# EAGLE design radio (EAGLE 9.6.1)
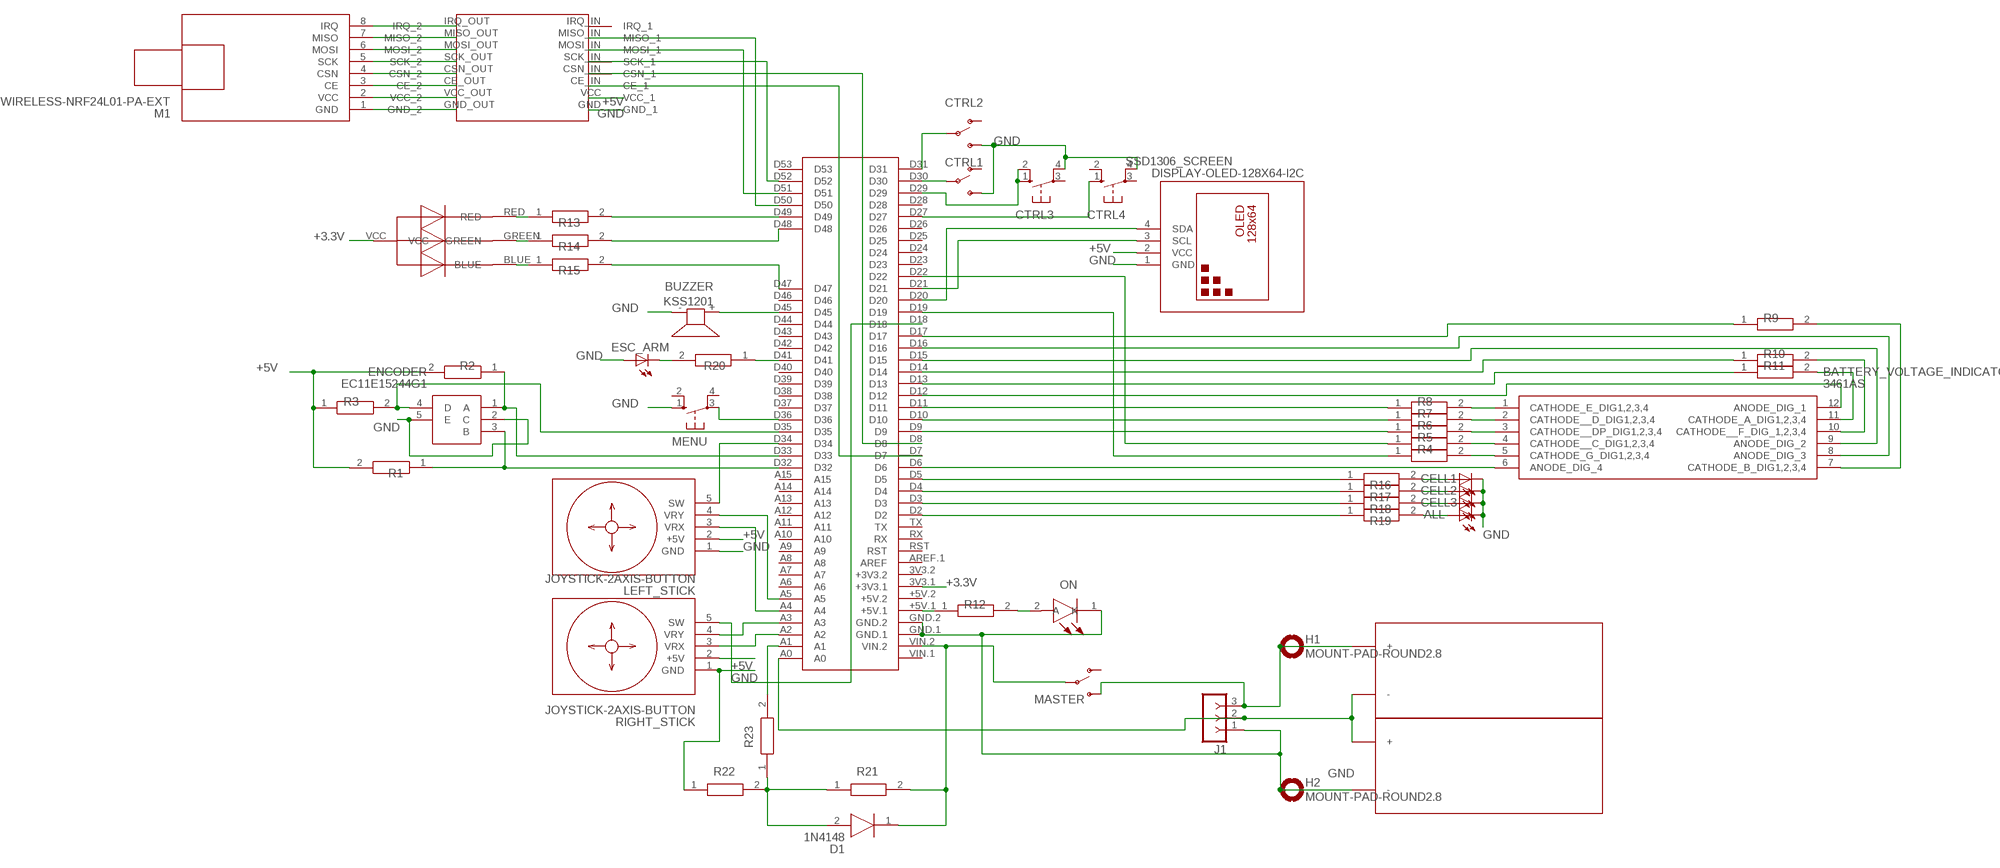
[diagram p0: schematic, sheet 1]

## Parts
ALL  LED3MM  [LED3MM]
BATTERY_VOLTAGE_INDICATOR  3461AS  [DIPS1016W45P254L3000H740Q12N]
BUZZER  KSS1201  [KSS1201]
CELL1  LED3MM  [LED3MM]
CELL2  LED3MM  [LED3MM]
CELL3  LED3MM  [LED3MM]
CTRL1  SWITCH-SPDT-PTH-8.6X4.3MM  [SWITCH_SPDT_8.6X4.3MM]
CTRL2  SWITCH-SPDT-PTH-8.6X4.3MM  [SWITCH_SPDT_8.6X4.3MM]
CTRL3  10-XX  [B3F-10XX]
CTRL4  10-XX  [B3F-10XX]
D1  1N4148  [DIOAD1165W56L425D185]
ENCODER  EC11E15244G1  [EC11E1544505]
ESC_ARM  LED3MM  [LED3MM]
GEAR  5MMRGBLED  [LED5MMRGB]
H1  MOUNT-PAD-ROUND2.8  [2,8-PAD]
H2  MOUNT-PAD-ROUND2.8  [2,8-PAD]
J1  F-1X03-SIP-100-32  [SIP-100-03-32]
LEFT_STICK  JOYSTICK-2AXIS-BUTTON  [JOYSTICK-2AXIS-BUTTON]
M1  WIRELESS-NRF24L01-PA-EXT  [WIRELESS-NRF24L01-PA-EXT]
MASTER  SWITCH-SPDT-PTH-8.6X4.3MM  [SWITCH_SPDT_8.6X4.3MM]
MENU  10-XX  [B3F-10XX]
ON  SSL-LX5093UWC_G  [SSL-LX5093SGC/B]
R1  CRCW120610K0FKEAHP  [RESC3116X65N]
R2  CRCW120610K0FKEAHP  [RESC3116X65N]
R3  CRCW120610K0FKEAHP  [RESC3116X65N]
R4  CR1206-FX-3300ELF  [RESC3216X75N]
R5  CR1206-FX-3300ELF  [RESC3216X75N]
R6  CR1206-FX-3300ELF  [RESC3216X75N]
R7  CR1206-FX-3300ELF  [RESC3216X75N]
R8  CR1206-FX-3300ELF  [RESC3216X75N]
R9  CR1206-FX-3300ELF  [RESC3216X75N]
R10  CR1206-FX-3300ELF  [RESC3216X75N]
R11  CR1206-FX-3300ELF  [RESC3216X75N]
R12  CRCW1206470RFKEA  [RESC3216X60N]
R13  CR1206-FX-3300ELF  [RESC3216X75N]
R14  CR1206-FX-3300ELF  [RESC3216X75N]
R15  CR1206-FX-3300ELF  [RESC3216X75N]
R16  CRG1206F150R  [RESC3116X65N]
R17  CRG1206F150R  [RESC3116X65N]
R18  CRG1206F150R  [RESC3116X65N]
R19  CRG1206F150R  [RESC3116X65N]
R20  CRG1206F150R  [RESC3116X65N]
R21  CRS1206-FX-1001ELF  [RESC3116X65N]
R22  CRS1206-FX-1001ELF  [RESC3116X65N]
R23  CRS1206-FX-1001ELF  [RESC3116X65N]
RIGHT_STICK  JOYSTICK-2AXIS-BUTTON  [JOYSTICK-2AXIS-BUTTON]
SSD1306_SCREEN  DISPLAY-OLED-128X64-I2C  [DISPLAY-OLED-128X64-I2C]
U$1  LIPO-CELL  (no package)
U$2  LIPO-CELL  (no package)
U$3  YL-105-ADAPTER-NRF24L01  [YL-105]
U$8  MEGA2560_MIKRO  [MEGA2560_MIKRO]

## Nets
+3.3V [test]: GEAR.VCC U$8.3V3.1(+3V3.1)
+5V [master]: LEFT_STICK.2(+5V) R1.2 R2.2 R3.1 RIGHT_STICK.2(+5V) SSD1306_SCREEN.2(VCC) U$3.VCC(VCC_1)
GND [master]: ALL.K(C) BUZZER.- CELL1.K(C) CELL2.K(C) CELL3.K(C) CTRL1.3(S) CTRL2.3(S) CTRL3.4(P1) CTRL4.4(P1) ENCODER.2(C) ENCODER.5(E) ESC_ARM.A H2.B2,8(MOUNT) J1.1 LEFT_STICK.1(GND) MENU.1(S) ON.1(K) R22.1 RIGHT_STICK.1(GND) SSD1306_SCREEN.1(GND) U$2.- U$3.GND(GND_1) U$8.GND.1 U$8.GND.2
N$1 [test]: M1.1(GND) U$3.GND_OUT(GND_2)
N$2 [test]: M1.2(VCC) U$3.VCC_OUT(VCC_2)
N$3 [test]: M1.3(CE) U$3.CE_OUT(CE_2)
N$4 [test]: M1.4(CSN) U$3.CSN_OUT(CSN_2)
N$5 [test]: M1.5(SCK) U$3.SCK_OUT(SCK_2)
N$6 [test]: M1.6(MOSI) U$3.MOSI_OUT(MOSI_2)
N$7 [test]: M1.7(MISO) U$3.MISO_OUT(MISO_2)
N$8 [test]: M1.8(IRQ) U$3.IRQ_OUT(IRQ_2)
N$9 [test]: J1.2 U$1.- U$2.+ U$8.A0
N$10 [test]: R23.2 U$8.A1
N$11 [test]: BATTERY_VOLTAGE_INDICATOR.6(ANODE_DIG_4) U$8.D6
N$12 [test]: BATTERY_VOLTAGE_INDICATOR.5(CATHODE_G_DIG1,2,3,4) R6.2
N$13 [test]: R6.1 U$8.D19
N$14 [test]: BATTERY_VOLTAGE_INDICATOR.4(CATHODE__C_DIG1,2,3,4) R5.2
N$15 [test]: R5.1 U$8.D22
N$16 [test]: R4.1 U$8.D9
N$17 [test]: R7.1 U$8.D10
N$18 [test]: R8.1 U$8.D11
N$19 [test]: BATTERY_VOLTAGE_INDICATOR.1(CATHODE_E_DIG1,2,3,4) R8.2
N$20 [test]: BATTERY_VOLTAGE_INDICATOR.2(CATHODE__D_DIG1,2,3,4) R7.2
N$21 [test]: BATTERY_VOLTAGE_INDICATOR.3(CATHODE__DP_DIG1,2,3,4) R4.2
N$22 [test]: BATTERY_VOLTAGE_INDICATOR.12(ANODE_DIG_1) U$8.D12
N$23 [test]: R11.1 U$8.D13
N$24 [test]: R10.1 U$8.D14
N$25 [test]: BATTERY_VOLTAGE_INDICATOR.9(ANODE_DIG_2) U$8.D15
N$26 [test]: BATTERY_VOLTAGE_INDICATOR.8(ANODE_DIG_3) U$8.D16
N$27 [test]: R9.1 U$8.D17
N$28 [test]: RIGHT_STICK.4(VRY) U$8.A3
N$29 [test]: RIGHT_STICK.3(VRX) U$8.A2
N$30 [test]: LEFT_STICK.3(VRX) U$8.A4
N$31 [test]: LEFT_STICK.4(VRY) U$8.A5
N$32 [test]: BATTERY_VOLTAGE_INDICATOR.7(CATHODE_B_DIG1,2,3,4) R9.2
N$33 [test]: BATTERY_VOLTAGE_INDICATOR.10(CATHODE__F_DIG_1,2,3,4) R10.2
N$34 [test]: BATTERY_VOLTAGE_INDICATOR.11(CATHODE_A_DIG1,2,3,4) R11.2
N$35 [test]: SSD1306_SCREEN.4(SDA) U$8.D20
N$36 [test]: SSD1306_SCREEN.3(SCL) U$8.D21
N$37 [test]: ENCODER.1(A) R2.1 U$8.D33
N$38 [test]: ENCODER.3(B) R1.1 U$8.D32
N$39 [test]: ENCODER.4(D) R3.2 U$8.D35
N$40 [test]: D1.2(A) R21.1 R22.2 R23.1
N$41 [test]: LEFT_STICK.5(SW) U$8.D34
N$42 [test]: CELL1.A R16.2
N$43 [test]: BUZZER.+ U$8.D45
N$44 [test]: RIGHT_STICK.5(SW) U$8.D18
N$45 [test]: CELL2.A R17.2
N$46 [test]: CELL3.A R18.2
N$47 [test]: ALL.A R19.2
N$48 [test]: MENU.3(P) U$8.D36
N$49 [test]: ON.2(A) R12.2
N$50 [test]: CTRL1.2(P) U$8.D30
N$51 [test]: CTRL2.2(P) U$8.D31
N$52 [test]: CTRL3.1(S) CTRL3.2(S1) U$8.D29
N$53 [test]: CTRL4.1(S) U$8.D27
N$55 [test]: R12.1 U$8.+5V.1
N$56 [test]: GEAR.RED R13.1
N$57 [test]: GEAR.GREEN R14.1
N$58 [test]: GEAR.BLUE R15.1
N$59 [test]: R13.2 U$8.D49
N$60 [test]: R14.2 U$8.D48
N$61 [test]: R15.2 U$8.D47
N$62 [test]: R16.1 U$8.D5
N$63 [test]: R17.1 U$8.D4
N$64 [test]: R18.1 U$8.D3
N$65 [test]: R19.1 U$8.D2
N$66 [test]: U$3.MISO_IN(MISO_1) U$8.D50
N$67 [test]: U$3.MOSI_IN(MOSI_1) U$8.D51
N$68 [test]: U$3.SCK_IN(SCK_1) U$8.D52
N$69 [test]: U$3.CSN_IN(CSN_1) U$8.D8
N$70 [test]: U$3.CE_IN(CE_1) U$8.D7
N$71 [test]: R20.1 U$8.D41
N$72 [test]: ESC_ARM.K(C) R20.2
VIN [master]: H1.B2,8(MOUNT) J1.3 MASTER.3(S) U$1.+
VIN_SW [master]: D1.1(K) MASTER.2(P) R21.2 U$8.VIN.2
Unconnected: CTRL1.1(O) CTRL2.1(O) CTRL3.3(P) CTRL4.2(S1) CTRL4.3(P) MASTER.1(O) MENU.2(S1) MENU.4(P1) U$3.IRQ_IN(IRQ_1) U$8.3V3.2(+3V3.2) U$8.+5V.2 U$8.A6 U$8.A7 U$8.A8 U$8.A9 U$8.A10 U$8.A11 U$8.A12 U$8.A13 U$8.A14 U$8.A15 U$8.AREF.1(AREF) U$8.D23 U$8.D24 U$8.D25 U$8.D26 U$8.D28 U$8.D37 U$8.D38 U$8.D39 U$8.D40 U$8.D42 U$8.D43 U$8.D44 U$8.D46 U$8.D53 U$8.RST U$8.RX U$8.TX U$8.VIN.1

## Library data of the parts
ALL CELL1-CELL3 ESC_ARM = adafruit:LED: LED OSRAM: - CHIPLED LG R971, LG N971, LY N971, LG Q971, LY Q971, LO R971, LY R971 LH N974, LH R974 LS Q976, LO Q976, LY Q976 LO Q996 - Hyper CHIPLED LW Q18S LB Q993, LB Q99A, LB R99A - SideLED LS A670, LO A670, LY A670, LG A670, LP A670 LB A673, LV A673, LT A673, LW A673 LH A674 LY A675 LS A676, LA A676, LO A676, LY A676, LW A676 LS A679, LY A679, LG A679 - Hyper Micro SIDELED® LS Y876, LA Y876, LO Y876, LY Y876 LT Y87S - SmartLED LW L88C, LW L88S LB L89C, LB L89S, LG L890 LS L89K, LO L89K, LY L89K LS L896, LA L896, LO L896, LY L896 - TOPLED LS T670, LO T670, LY T670, LG T670, LP T670 LSG T670, LSP T670, LSY T670, LOP T670, LYG T670 LG T671, LOG T671, LSG T671 LB T673, LV T673, LT T673, LW T673 LH T674 LS T676, LA T676, LO T676, LY T676, LB T676, LH T676, LSB T676, LW T676 LB T67C, LV T67C, LT T67C, LS T67K, LO T67K, LY T67K, LW E67C LS E67B, LA E67B, LO E67B, LY E67B, LB E67C, LV E67C, LT E67C LW T67C LS T679, LY T679, LG T679 LS T770, LO T770, LY T770, LG T770, LP T770 LB T773, LV T773, LT T773, LW T773 LH T774 LS E675, LA E675, LY E675, LS T675 LS T776, LA T776, LO T776, LY T776, LB T776 LHGB T686 LT T68C, LB T68C - Hyper Mini TOPLED® LB M676 - Mini TOPLED Santana® LG M470 LS M47K, LO M47K, LY M47K Source: http://www.osram.convergy.de/
BATTERY_VOLTAGE_INDICATOR = 3461AS:3461AS: Four digit Led Digit Display Source: Datasheet; ARROW_PART_NUMBER: 3461AS; DESCRIPTION: Four digit Led Digit Display; HEIGHT: 7.4mm; MANUFACTURER_NAME: ZHONGSHAN SILSMART OPTOELECTRONICS; MANUFACTURER_PART_NUMBER: 3461AS
BUZZER = buzzer:KSS1201: SPEAKER Source: Schukat; OC_FARNELL: unknown; OC_NEWARK: unknown
CTRL1 CTRL2 MASTER = SparkFun-Switches:SWITCH-SPDT: Single Pole, Double Throw (SPDT) Switch Single-pole, double-throw (SPDT) switch. Variant Overview SMD-AYZ0202 Surface Mount DPDT Switch (COM-00597) Used on e.g. LilyPad Arduino USB - ATmega32U4 Board PTH-11.6X4.0MM SPDT Mini Power Switch (COM-00102) Used on e.g. SparkFun Simon Says - Through-Hole Soldering Kit (KIT-10547) PTH-11.6X4.0MM-KIT KIT version of SPDT Mini Power Switch - Simplifies soldering by removing tStop of switch pins - only one side can be soldered. PTH-11.6X4.0MM-LOCK LOCK version of SPDT Mini Power Switch - Offset pins hold switch in place for easier soldering. SMD-RIGHT-ANGLE Surface Mount Right Angle Switch (COM-10860) Used on e.g. SparkFun ESP8266 Thing; PROD_ID: SWCH-14746
CTRL3 CTRL4 MENU = switch-omron:10-XX: OMRON SWITCH; MPN: B3F-1000; OC_FARNELL: 176432; OC_NEWARK: 36M3542
D1 = 1N4148:1N4148: 1N4148 Switching Diode, 300mA 100V, 2-Pin DO-35 Source: Datasheet; ARROW_PART_NUMBER: 1N4148; DESCRIPTION: 1N4148 Switching Diode, 300mA 100V, 2-Pin DO-35; HEIGHT: mm; MANUFACTURER_NAME: Nexperia; MANUFACTURER_PART_NUMBER: 1N4148
ENCODER = EC11E15244G1:EC11E15244G1: Alps 15 Pulse Incremental Mechanical Rotary Encoder with a 6 mm Flat Shaft (Not Indexed), Through Hole Source: Datasheet; ARROW_PART_NUMBER: EC11E15244G1; DESCRIPTION: Alps 15 Pulse Incremental Mechanical Rotary Encoder with a 6 mm Flat Shaft (Not Indexed), Through Hole; HEIGHT: mm; MANUFACTURER_NAME: ALPS; MANUFACTURER_PART_NUMBER: EC11E15244G1; MOUSER_PART_NUMBER: 688-EC11E15244G1; MOUSER_PRICE-STOCK: https://www.mouser.com/Search/Refine.aspx?Keyword=688-EC11E15244G1
GEAR = led_rgb:5MMRGBLED
H1 H2 = holes:MOUNT-PAD-ROUND: MOUNTING PAD, round
J1 = con-headers-jp:F-1X03-: FEMALE HEADER
LEFT_STICK RIGHT_STICK = diy-modules:JOYSTICK-2AXIS-BUTTON: 2-Axis Analog Joystick with Push Button Tutorial is available here: http://henrysbench.capnfatz.com/henrys-bench/arduino-sensors-and-input/arduino-ps2-joystick-tutorial-keyes-ky-023-deek-robot/ Click here to find device on ebay.com
M1 = diy-modules:WIRELESS-NRF24L01-PA-EXT: 2.4 GHz Wireless Module based on NRF24L01 chip with preamplifier and external antenna Click here to find device on ebay.com
ON = SamacSys_Parts:SSL-LX5093UWC_G: Lumex SSL-LX5093UWC/G White LED, 5mm (T-1 3/4) Clear, Dome Lens Through Hole Package Source: Datasheet; DESCRIPTION: Lumex SSL-LX5093UWC/G White LED, 5mm (T-1 3/4) Clear, Dome Lens Through Hole Package; HEIGHT: mm; MANUFACTURER_NAME: Lumex; MANUFACTURER_PART_NUMBER: SSL-LX5093UWC/G; MOUSER_PART_NUMBER: 696-SSL-LX5093UWC/G; MOUSER_PRICE-STOCK: https://www.mouser.com/Search/Refine.aspx?Keyword=696-SSL-LX5093UWC%2FG; RS_PART_NUMBER: 8887206; RS_PRICE-STOCK: http://uk.rs-online.com/web/p/products/8887206
R1-R3 = CRCW120610K0FKEAHP:CRCW120610K0FKEAHP: Thick Film Resistors - SMD 1/2watt 10Kohms 1% 100ppm High Power Source: Datasheet; ARROW_PART_NUMBER: CRCW120610K0FKEAHP; ARROW_PRICE-STOCK: https://www.arrow.com/en/products/crcw120610k0fkeahp/vishay; DESCRIPTION: Thick Film Resistors - SMD 1/2watt 10Kohms 1% 100ppm High Power; HEIGHT: 0.65mm; MANUFACTURER_NAME: Vishay; MANUFACTURER_PART_NUMBER: CRCW120610K0FKEAHP; MOUSER_PART_NUMBER: 71-CRCW120610K0FKEAH; MOUSER_PRICE-STOCK: https://www.mouser.co.uk/ProductDetail/Vishay-Dale/CRCW120610K0FKEAHP?qs=sV%252BHhSlSMtlZIIGeH8S5qg%3D%3D
R4-R11 R13-R15 = CR1206-FX-3300ELF:CR1206-FX-3300ELF: SMD 1206 thick film resistor 330R 1% Bourns CR1206-FX Series Surface Mount Fixed Resistor 1206 Case 330 +/-1% 0.25W +/-100ppm/C Source: Datasheet; ARROW_PART_NUMBER: CR1206-FX-3300ELF; ARROW_PRICE-STOCK: https://www.arrow.com/en/products/cr1206-fx-3300elf/bourns; DESCRIPTION: SMD 1206 thick film resistor 330R 1% Bourns CR1206-FX Series Surface Mount Fixed Resistor 1206 Case 330 +/-1% 0.25W +/-100ppm/C; HEIGHT: 0.75mm; MANUFACTURER_NAME: Bourns; MANUFACTURER_PART_NUMBER: CR1206-FX-3300ELF; MOUSER_PART_NUMBER: 652-CR1206FX-3300ELF; MOUSER_PRICE-STOCK: https://www.mouser.co.uk/ProductDetail/Bourns/CR1206-FX-3300ELF?qs=raSpJxvwqHEmBNP%252BYszUFw%3D%3D
R12 = CRCW1206470RFKEA:CRCW1206470RFKEA: VISHAY DRALORIC - CRCW1206470RFKEA - RES, THICK FILM, 470R, 1%, 0.25W, 1206 Source: Datasheet; ARROW_PART_NUMBER: CRCW1206470RFKEA; ARROW_PRICE-STOCK: https://www.arrow.com/en/products/crcw1206470rfkea/vishay; DESCRIPTION: VISHAY DRALORIC - CRCW1206470RFKEA - RES, THICK FILM, 470R, 1%, 0.25W, 1206; HEIGHT: 0.6mm; MANUFACTURER_NAME: Vishay; MANUFACTURER_PART_NUMBER: CRCW1206470RFKEA; MOUSER_PART_NUMBER: 71-CRCW1206-470-E3; MOUSER_PRICE-STOCK: https://www.mouser.co.uk/ProductDetail/Vishay-Dale/CRCW1206470RFKEA?qs=9sFvXT%252Bien0hfb5%2FAQcBUQ%3D%3D
R16-R20 = CRG1206F150R:CRG1206F150R: CRG1206 SMT chip resistor,150R 0.25W TE Connectivity CRG1206 Series Thick Film Surface Mount Resistor 1206 Case 150 +/-1% 0.25W +/-100ppm/C Source: Datasheet; ARROW_PART_NUMBER: CRG1206F150R; ARROW_PRICE-STOCK: https://www.arrow.com/en/products/crg1206f150r/te-connectivity; DESCRIPTION: CRG1206 SMT chip resistor,150R 0.25W TE Connectivity CRG1206 Series Thick Film Surface Mount Resistor 1206 Case 150 +/-1% 0.25W +/-100ppm/C; HEIGHT: 0.65mm; MANUFACTURER_NAME: TE Connectivity; MANUFACTURER_PART_NUMBER: CRG1206F150R; MOUSER_PART_NUMBER: 279-CRG1206F150R; MOUSER_PRICE-STOCK: https://www.mouser.com/Search/Refine.aspx?Keyword=279-CRG1206F150R
R21-R23 = CRS1206-FX-1001ELF:CRS1206-FX-1001ELF: 1k 1206 Thick Film Anti Surge Fixed Resistor +/-1% 0.5W CRS1206-FX-1001ELF Source: Datasheet; ARROW_PART_NUMBER: CRS1206-FX-1001ELF; ARROW_PRICE-STOCK: https://www.arrow.com/en/products/crs1206-fx-1001elf/bourns; DESCRIPTION: 1k 1206 Thick Film Anti Surge Fixed Resistor +/-1% 0.5W CRS1206-FX-1001ELF; HEIGHT: 0.65mm; MANUFACTURER_NAME: Bourns; MANUFACTURER_PART_NUMBER: CRS1206-FX-1001ELF; MOUSER_PART_NUMBER: 652-CRS1206FX1001ELF; MOUSER_PRICE-STOCK: https://www.mouser.com/Search/Refine.aspx?Keyword=652-CRS1206FX1001ELF
SSD1306_SCREEN = diy-modules:DISPLAY-OLED-128X64-I2C: 128x64 Dot Matrix OLED Module based on SSD1306 chip Variant with I2C interface More details available here: http://www.instructables.com/id/Monochrome-096-i2c-OLED-display-with-arduino-SSD13/ SSD1306 datasheet: https://cdn-shop.adafruit.com/datasheets/SSD1306.pdf Click here to find device on ebay.com Note: There are two variants: I2C and SPI. Search for the proper version.
U$1 U$2 = SamacSys_Parts:LIPO-CELL
U$3 = diy-modules:YL-105-ADAPTER-NRF24L01
U$8 = MIKRO_MEGA2560:MEGA2560_MIKRO: Arduino Mega2560 pro robotDyn, create by mikroavr.com

## Module KY-040
Ports: 

### Library data of the parts

## Net classes
0 default: width 0.61 mm
1 test: width 0.61 mm, clearance 0.051 mm
2 master: width 0.762 mm, clearance 0.254 mm

## Board
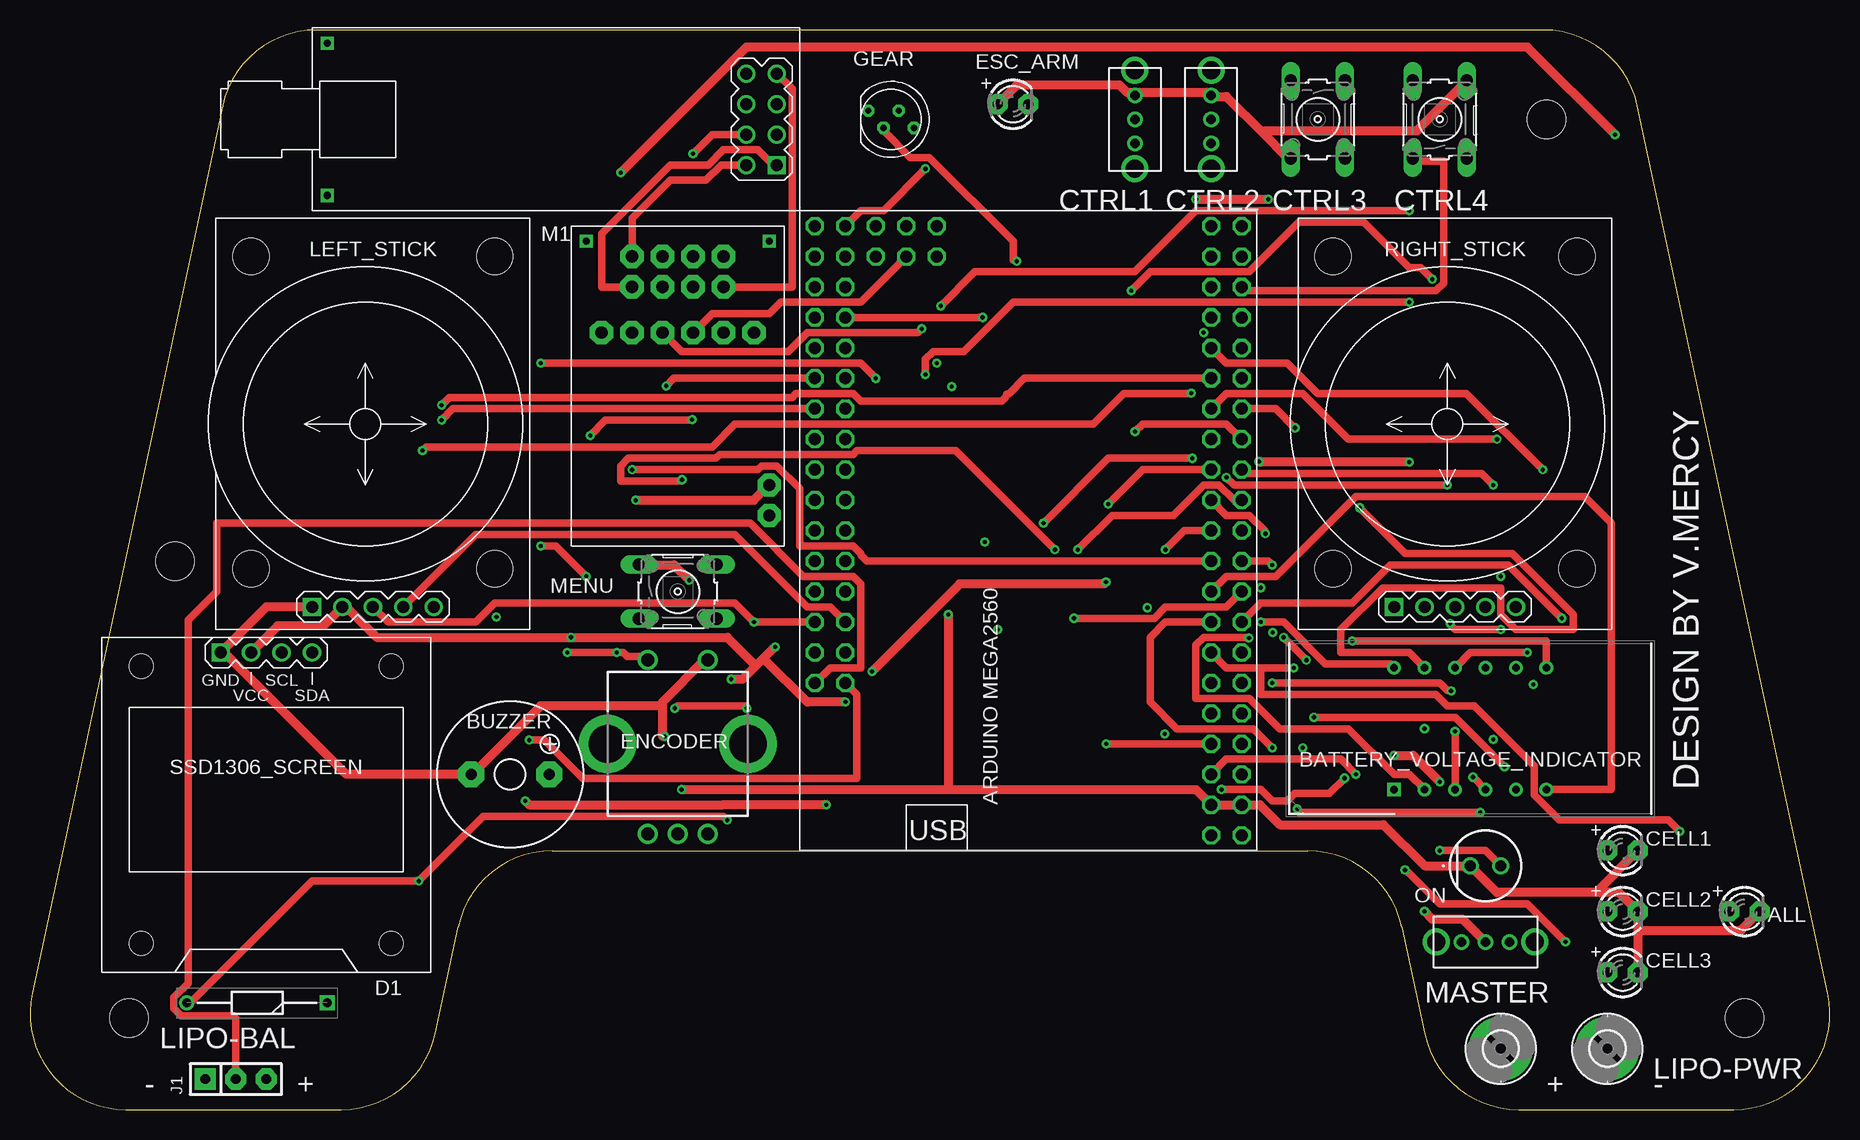
[diagram p1: board, top side]
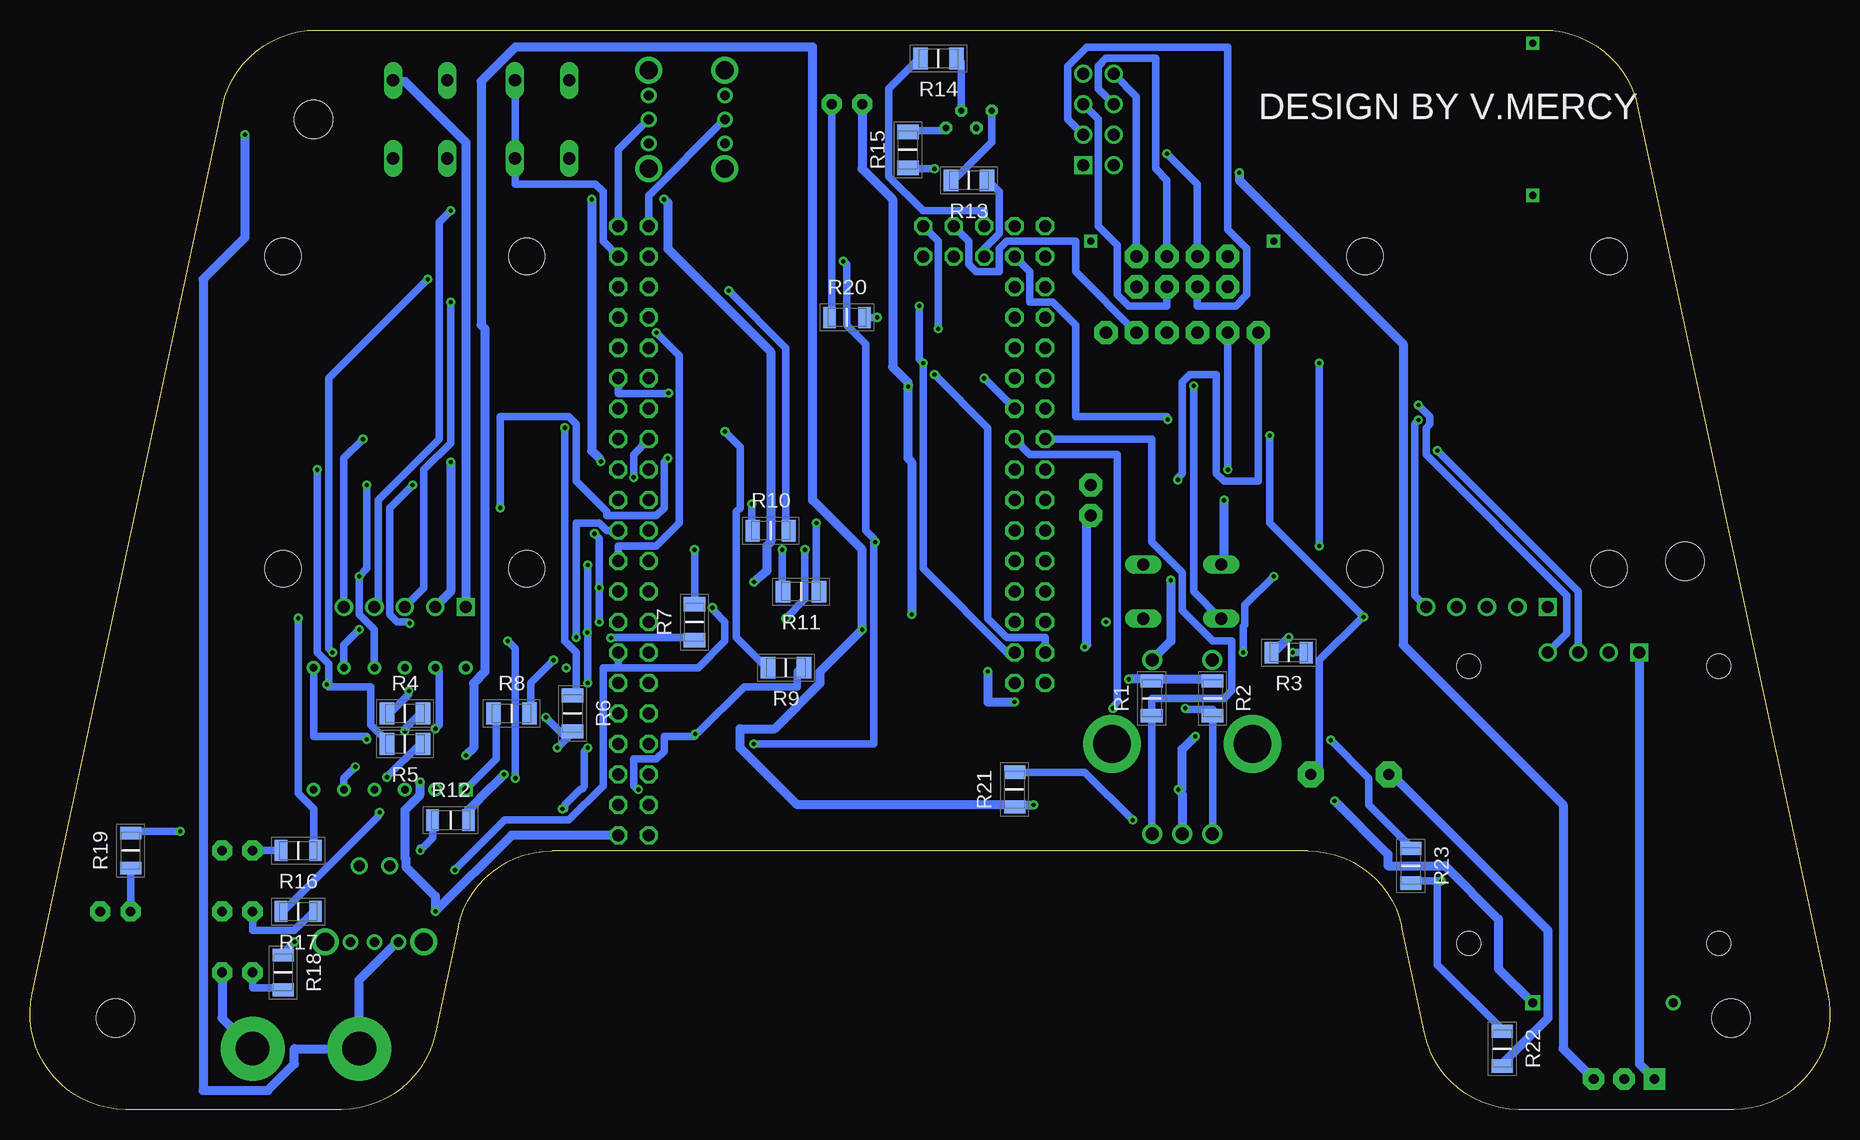
[diagram p2: board, bottom side, seen from below]

Size 150 x 90 mm. Coordinates in mm from the lower left corner, seen from the top.
Outline: 23.87,90 arc78 16.04,83.68 0.18,9.68 arc102 8,0 25.95,0 arc78 33.77,6.32 35.68,15.24 arc-78 43.5,21.56 106.49,21.56 arc-78 114.32,15.24 116.23,6.32 arc78 124.05,0 142,0 arc102 149.82,9.68 133.95,83.68 arc78 126.13,90 23.87,90
Copper layers (1*16): Top 0.035mm / dielectric 1.5mm / Bottom 0.035mm
Design rules "default": minimum track width 6mil, minimum drill 0.35mm, track to track 6mil, track to pad 6mil, pad to pad 6mil, via to via 6mil, smd to smd 6mil, copper to edge 40mil, drill to drill 6mil, minimum pad ring 10mil, minimum via ring 8mil, stop-mask expansion 4mil, vias tented up to drill 0mil, thermal gap 10mil
Holes 3.2 mm at 8.26,7.62 12.07,45.72 126.37,82.55 142.88,7.62

### Footprints (pad centres in the part's own frame; a part is rotated, then mirrored left to right if it is on the bottom)
LED3MM = drill 0.813 pad 1.676 octagon: A -1.27,0; K 1.27,0
DIPS1016W45P254L3000H740Q12N = drill 0.65 pad 1.05 square: 1 0,0 | drill 0.65 pad 1.05: 2 0,-2.54; 3 0,-5.08; 4 0,-7.62; 5 0,-10.16; 6 0,-12.7; 7 10.16,-12.7; 8 10.16,-10.16; 9 10.16,-7.62; 10 10.16,-5.08; 11 10.16,-2.54; 12 10.16,0
KSS1201 = drill 0.914 pad 2.159 octagon: + 3.251,0; - -3.251,0
SWITCH_SPDT_8.6X4.3MM = drill 0.8: 1 -2,0; 2 0,0; 3 2,0 | drill 1.5: 4 -4.1,0; 5 4.1,0
B3F-10XX = drill 1.016 long: 1 -3.251,2.261; 2 3.251,2.261; 3 -3.251,-2.261; 4 3.251,-2.261
DIOAD1165W56L425D185 = drill 0.75 pad 1.15 square: 1 0,0 | drill 0.75 pad 1.15: 2 11.7,0
EC11E1544505 = drill 1.1 pad 1.65: 1 -2.5,-7.5; 2 0,-7.5; 3 2.5,-7.5; 4 -2.5,7; 5 2.5,7 | drill 3.14 pad 4.8: 6 -5.85,0; 7 5.85,0
LED5MMRGB = drill 0.508 pad 0.813 octagon: BLUE 1.905,-0.714; GREEN 0.635,0.714; RED -1.905,0.714; VCC -0.635,-0.714
2,8-PAD = drill 2.8 pad 5.334: B2,8 0,0
SIP-100-03-32 = drill 0.813 pad 1.778 square: 1 -2.54,0 | drill 0.813 pad 1.778 octagon: 2 0,0; 3 2.54,0
JOYSTICK-2AXIS-BUTTON = drill 1 square: 1 -15.24,5.08 | drill 1: 2 -15.24,2.54; 3 -15.24,0; 4 -15.24,-2.54; 5 -15.24,-5.08 | hole 3: -12.065,10.16; -12.065,-10.16; 13.97,-10.16; 13.97,10.16
WIRELESS-NRF24L01-PA-EXT = drill 1 square: 1 -18.415,3.81 | drill 1: 2 -15.875,3.81; 3 -18.415,1.27; 4 -15.875,1.27; 5 -18.415,-1.27; 6 -15.875,-1.27; 7 -18.415,-3.81; 8 -15.875,-3.81 | drill 0.6 square: P$1 19.05,6.35; P$2 19.05,-6.35
SSL-LX5093SGC/B = drill 0.91 pad 1.4: 1 1.27,0; 2 -1.27,0
RESC3116X65N = smd 1.1 x 1.8: 1 -1.45,0; 2 1.45,0
RESC3216X75N = smd 1.2 x 1.8: 1 -1.5,0; 2 1.5,0
RESC3216X60N = smd 1.05 x 1.8: 1 -1.5,0; 2 1.5,0
RESC3116X65N' = smd 1.05 x 1.75: 1 -1.45,0; 2 1.45,0
RESC3116X65N'' = smd 1.1 x 1.75: 1 -1.45,0; 2 1.45,0
DISPLAY-OLED-128X64-I2C = drill 1 square: 1 -3.81,12.7 | drill 1: 2 -1.27,12.7; 3 1.27,12.7; 4 3.81,12.7 | hole 2: -10.414,11.557; 10.414,11.557; 10.414,-11.557; -10.414,-11.557
YL-105 = drill 1.016 pad 1.93 octagon: CE_IN 2.54,17.78; CE_OUT 7.62,21.59; CSN_IN 5.08,17.78; CSN_OUT 7.62,24.13; GND 16.51,5.08; GND_OUT 5.08,21.59; IRQ_IN 15.24,17.78; IRQ_OUT 12.7,24.13; MISO_IN 12.7,17.78; MISO_OUT 12.7,21.59; MOSI_IN 10.16,17.78; MOSI_OUT 10.16,24.13; SCK_IN 7.62,17.78; SCK_OUT 10.16,21.59; VCC 16.51,2.54; VCC_OUT 5.08,24.13 | drill 0.6 square: MH1 1.27,25.4; MH2 16.51,25.4
MEGA2560_MIKRO = drill 1 octagon: 3V3.1 -26.67,-17.78; 3V3.2 -26.67,-20.32; +5V.1 -29.21,-17.78; +5V.2 -29.21,-20.32; A0 -21.59,15.24; A1 -21.59,12.7; A2 -19.05,15.24; A3 -19.05,12.7; A4 -16.51,15.24; A5 -16.51,12.7; A6 -13.97,15.24; A7 -13.97,12.7; A8 -11.43,15.24; A9 -11.43,12.7; A10 -8.89,15.24; A11 -8.89,12.7; A12 -6.35,15.24; A13 -6.35,12.7; A14 -3.81,15.24; A15 -3.81,12.7; AREF.1 -24.13,-17.78; D2 -19.05,-17.78; D3 -19.05,-20.32; D4 -16.51,-17.78; D5 -16.51,-20.32; D6 -13.97,-17.78; D7 -13.97,-20.32; D8 -11.43,-17.78; D9 -11.43,-20.32; D10 -8.89,-17.78; D11 -8.89,-20.32; D12 -6.35,-17.78; D13 -6.35,-20.32; D14 -3.81,-17.78; D15 -3.81,-20.32; D16 -1.27,-17.78; D17 -1.27,-20.32; D18 1.27,-17.78; D19 1.27,-20.32; D20 3.81,-17.78; D21 3.81,-20.32; D22 6.35,-17.78; D23 6.35,-20.32; D24 8.89,-17.78; D25 8.89,-20.32; D26 11.43,-17.78; D27 11.43,-20.32; D28 13.97,-17.78; D29 13.97,-20.32; D30 16.51,-17.78; D31 16.51,-20.32; D32 -1.27,15.24; D33 -1.27,12.7; D34 1.27,15.24; D35 1.27,12.7; D36 3.81,15.24; D37 3.81,12.7; D38 6.35,15.24; D39 6.35,12.7; D40 8.89,15.24; D41 8.89,12.7; D42 11.43,15.24; D43 11.43,12.7; D44 13.97,15.24; D45 13.97,12.7; D46 16.51,15.24; D47 16.51,12.7; D48 16.51,10.16; D49 13.97,10.16; D50 16.51,7.62; D51 13.97,7.62; D52 16.51,5.08; D53 13.97,5.08; GND.1 -31.75,-17.78; GND.2 -31.75,-20.32; RST -24.13,-20.32; RX -21.59,-17.78; TX -21.59,-20.32; VIN.1 -34.29,-17.78; VIN.2 -34.29,-20.32

### Placement (x,y rotation side)
ALL  142.88,16.51 0 top
BATTERY_VOLTAGE_INDICATOR  113.67,26.67 90 top
BUZZER  40.01,27.94 0 top
CELL1  132.72,21.59 0 top
CELL2  132.72,16.51 0 top
CELL3  132.72,11.43 0 top
CTRL1  92.08,82.55 90 top
CTRL2  98.43,82.55 90 top
CTRL3  107.32,82.55 270 top
CTRL4  117.48,82.55 90 top
D1  24.77,8.89 180 top
ENCODER  53.98,30.48 0 top
ESC_ARM  81.92,83.82 0 top
GEAR  71.76,82.55 0 top
H1  122.56,5.08 0 top
H2  131.45,5.08 0 top
J1  17.15,2.54 0 top
LEFT_STICK  28.58,57.15 90 top
M1  43.82,82.55 180 top
MASTER  121.29,13.97 180 top
MENU  53.98,43.18 0 top
ON  121.29,20.32 180 top
R1  56.52,34.29 90 bottom
R2  51.44,34.29 90 bottom
R3  45.09,38.1 0 bottom
R4  118.75,33.02 0 bottom
R5  118.75,30.48 0 bottom
R6  104.78,33.02 270 bottom
R7  94.62,40.64 270 bottom
R8  109.86,33.02 180 bottom
R9  87,36.83 0 bottom
R10  88.27,48.26 0 bottom
R11  85.73,43.18 0 bottom
R12  114.94,24.13 180 bottom
R13  71.76,77.47 0 bottom
R14  74.3,87.63 180 bottom
R15  76.84,80.01 270 bottom
R16  CRG1206F150R  [RESC3116X65N']  127.64,21.59 180 bottom
R17  CRG1206F150R  [RESC3116X65N']  127.64,16.51 0 bottom
R18  CRG1206F150R  [RESC3116X65N']  128.91,11.43 270 bottom
R19  CRG1206F150R  [RESC3116X65N']  141.61,21.59 270 bottom
R20  CRG1206F150R  [RESC3116X65N']  81.92,66.04 180 bottom
R21  CRS1206-FX-1001ELF  [RESC3116X65N'']  67.95,26.67 270 bottom
R22  CRS1206-FX-1001ELF  [RESC3116X65N'']  27.31,5.08 90 bottom
R23  CRS1206-FX-1001ELF  [RESC3116X65N'']  34.93,20.32 90 bottom
RIGHT_STICK  118.75,57.15 90 top
SSD1306_SCREEN  19.69,25.4 0 top
U$3  45.09,46.99 0 top
U$8  80.65,57.15 90 top

### Tracks (layer width: path | path; a pad name or v marks a point on that pad's centre or on a via)
+3.3V  (via drill 0.35)
  Top 0.61: U$8.3V3.1 v89.69,30.48 | GEAR.VCC 71.13,81.6 73.35,79.38 74.94,79.38 81.92,72.39 81.92,70.8 v82.23,70.71
  Bottom 0.61: v82.23,70.71 81.92,70.48 81.92,65.41 80.33,63.82 80.33,48.26 79.7,47.62 v79.56,47.32 79.7,47.31 79.7,30.48 v89.69,30.48
+5V  (via drill 0.35)
  Top 0.762: 60.49,36.99 59.38,35.88 v58.43,35.88 | 60.49,36.99 61.12,37.62 | 61.12,37.62 61.92,38.42 v62.11,38.56 | SSD1306_SCREEN.2 20.64,40.32 24.45,40.32 LEFT_STICK.2 26.36,41.91 28.9,39.37 v45.09,39.37 58.11,39.37 60.49,36.99 | v114.94,53.98 102.56,53.98 v102.42,54.03 | v97.16,75.88 v103.19,75.88 | 61.12,37.62 64.78,33.97 v67.95,33.97 | v70.17,36.51 77.48,43.81 89.54,43.81 v89.67,43.97
  Bottom 0.762: v58.43,35.88 56.52,35.88 R1.2 56.2,35.88 51.44,35.88 R2.2 | U$3.VCC 61.92,49.21 61.92,38.73 v62.11,38.56 | v45.09,39.37 46.36,38.1 R3.1 | RIGHT_STICK.2 114.94,43.18 v114.94,53.98 | v97.16,75.88 96.84,75.56 96.84,71.75 88.27,63.18 88.27,47.31 88.59,46.99 88.59,44.9 v89.67,43.97 | v103.19,75.88 103.19,54.93 102.56,54.29 v102.42,54.03 | v67.95,33.97 70.17,33.97 v70.17,36.51
GND  (via drill 0.35)
  Top 0.762: LEFT_STICK.1 19.69,41.91 SSD1306_SCREEN.1 16.2,38.1 26.36,27.94 BUZZER.- 36.84,27.94 42.55,33.66 52.71,33.66 | v54.93,44.13 53.66,45.4 50.81,45.4 MENU.1 | U$3.GND 60.33,50.8 v50.49,50.8 | v54.3,26.67 76.52,26.67 | 76.52,26.67 97.16,26.67 U$8.GND.1 U$8.GND.2 102.5,25.4 104.15,23.75 112.78,23.75 116.21,20.32 ON.1 122.24,18.1 130.82,18.1 | 52.71,33.66 52.71,31.11 v52.89,31.11 | 52.71,33.66 52.71,33.97 56.2,37.47 56.47,37.47 ENCODER.5 | 130.82,18.1 132.4,18.1 CELL2.K 133.99,14.92 | 133.99,14.92 CELL3.K | ALL.K 142.56,14.92 133.99,14.92 | CELL1.K 130.82,18.41 130.82,18.1 | 102.72,81.44 99.7,84.45 98.75,84.45 CTRL2.3 98.43,84.77 92.08,84.77 CTRL1.3 91.76,84.77 91.45,84.77 90.81,85.41 82.24,85.41 ESC_ARM.A | 102.72,81.44 104.78,79.38 CTRL3.4 | CTRL4.4 119.7,85.72 115.58,81.6 102.88,81.6 102.72,81.44 | v76.52,41.27 76.52,26.67
  Bottom 0.762: J1.1 15.88,3.81 SSD1306_SCREEN.1 | R22.1 27.31,3.81 23.5,7.62 23.5,14.92 36.52,27.94 BUZZER.- | v50.49,50.8 50.49,45.72 MENU.1 | v54.93,44.13 54.93,39.05 56.48,37.51 ENCODER.5 | v52.89,31.11 53.98,30.02 53.98,26.67 v54.3,26.67 53.98,26.35 ENCODER.2 | H2.B2,8 133.99,7.62 CELL3.K | ESC_ARM.A 80.65,78.42 78.11,75.88 78.11,61.91 76.84,60.64 v76.82,60.27 76.84,60.01 76.84,54.29 76.52,53.98 v76.52,41.27 | RIGHT_STICK.1 113.67,80.64 118.75,85.72 119.7,85.72 CTRL4.4
N$1
  Top 0.61: M1.1 61.92,78.74 60.65,80.01 57.79,80.01 56.52,78.74 53.35,78.74 47.63,73.03 47.63,68.58 U$3.GND_OUT
N$2
  Top 0.61: U$3.VCC_OUT 50.17,74.3 53.35,77.47 56.33,77.47 57.6,78.74 M1.2
N$3
  Bottom 0.61: M1.3 63.51,82.55 63.51,87 61.92,88.58 50.17,88.58 50.17,73.34 48.58,71.75 48.58,67.94 49.54,66.99 52.71,66.99 U$3.CE_OUT
N$4  (via drill 0.35)
  Top 0.61: v55.25,79.69 56.84,81.28 M1.4
  Bottom 0.61: v55.25,79.69 52.71,77.15 U$3.CSN_OUT
N$5
  Bottom 0.61: M1.5 60.97,82.55 60.97,73.66 59.38,72.07 59.38,67.94 58.43,66.99 55.25,66.99 U$3.SCK_OUT
N$6
  Bottom 0.61: M1.6 60.97,85.09 60.97,87 60.33,87.63 56.2,87.63 56.2,78.42 55.25,77.47 U$3.MOSI_OUT
N$7
  Top 0.61: M1.7 63.51,85.09 63.51,68.58 U$3.MISO_OUT
N$8
  Bottom 0.61: M1.8 57.79,84.45 U$3.IRQ_OUT
N$9
  Top 0.61: J1.2 17.15,7.62 16.97,7.8 12.62,7.8 11.98,8.44 11.98,9.34 13.18,10.54 13.18,40.8 15.56,43.18 15.56,48.9 60.01,48.9 64.46,44.45 68.59,44.45 69.22,43.81 69.22,36.83 66.68,36.83 U$8.A0
N$10  (via drill 0.35)
  Top 0.61: U$8.A1 68.9,34.61 68.9,27.62 46.04,27.62 42.87,30.8 v41.6,30.8
  Bottom 0.61: v41.6,30.8 38.42,27.62 38.42,25.4 34.93,21.91 R23.2
N$11
  Top 0.61: BATTERY_VOLTAGE_INDICATOR.6 131.77,26.67 131.77,48.9 129.55,51.12 110.5,51.12 103.83,44.45 99.7,44.45 U$8.D6
N$12  (via drill 0.35)
  Top 0.61: v107,32.7 118.75,32.7 v122.88,28.57
  Bottom 0.61: v106.05,30.16 104.78,31.43 R6.2 105.42,31.11 v107,32.7 | v122.88,28.57 123.83,27.62 BATTERY_VOLTAGE_INDICATOR.5
N$13  (via drill 0.35)
  Top 0.61: v105.42,56.83 103.83,58.42 U$8.D19
  Bottom 0.61: v105.42,56.83 105.42,39.05 104.46,38.1 104.46,34.92 104.78,34.61 R6.1
N$14  (via drill 0.35)
  Top 0.61: BATTERY_VOLTAGE_INDICATOR.4 v120.25,27.71
  Bottom 0.61: v120.25,27.71 117.48,30.48 R5.2
N$15  (via drill 0.35)
  Top 0.61: U$8.D22 99.7,62.23 104.78,62.23 107.32,59.69 119.7,59.69 v126.05,53.34
  Bottom 0.61: R5.1 120.34,30.48 120.34,30.8 121.61,32.07 121.61,35.24 125.1,35.24 v125.28,35.43 125.1,35.56 125.1,37.15 126.05,38.1 v126.05,53.34
N$16  (via drill 0.35)
  Top 0.61: v103.51,45.4 103.19,45.72 U$8.D9 | v103.51,35.56 117.48,35.56 118.12,34.92 v118.42,34.9
  Bottom 0.61: v118.42,34.9 118.43,34.61 120.02,33.02 R4.1 | v103.51,45.4 103.51,40.01 v103.56,39.78 103.51,39.69 v103.51,35.56 | v97.8,64.77 95.89,62.87 95.89,48.9 97.8,46.99 100.97,46.99 U$8.D9
N$17  (via drill 0.35)
  Top 0.61: v94.62,46.67 96.21,48.26 U$8.D10
  Bottom 0.61: R7.1 v94.62,46.67
N$18  (via drill 0.35)
  Top 0.61: v106.37,37.47 v104.46,39.37
  Bottom 0.61: v106.37,37.47 108.27,35.56 108.27,33.02 R8.1 | U$8.D11 101.92,48.26 102.56,48.9 104.46,48.9 v104.46,39.37
N$19
  Bottom 0.61: BATTERY_VOLTAGE_INDICATOR.1 111.13,29.21 111.13,33.02 R8.2
N$20  (via drill 0.35)
  Top 0.61: v101.58,39.32 101.29,39.37 97.8,39.37 97.16,38.73 97.16,34.29 101.61,34.29 104.15,31.75 109.86,31.75 113.67,27.94 114.94,27.94 BATTERY_VOLTAGE_INDICATOR.2
  Bottom 0.61: v101.58,39.32 101.29,39.37 94.62,39.37 R7.2
N$21  (via drill 0.35)
  Top 0.61: BATTERY_VOLTAGE_INDICATOR.3 v118.75,31.52
  Bottom 0.61: v118.75,31.52 118.75,31.75 117.48,33.02 R4.2
N$22  (via drill 0.35)
  Top 0.61: BATTERY_VOLTAGE_INDICATOR.12 113.35,37.15 107.96,37.15 104.46,40.64 v102.56,40.64 | U$8.D12 99.7,49.53 101.61,49.53 102.88,48.26 v102.95,48.01
  Bottom 0.61: v102.56,40.64 v102.56,43.5 102.56,47.62 102.88,47.94 v102.95,48.01
N$23  (via drill 0.35)
  Top 0.61: v87.32,46.67 90.18,49.53 95.26,49.53 97.8,52.07 99.07,52.07 100.34,50.8 U$8.D13
  Bottom 0.61: v87.32,46.67 87.32,43.18 R11.1
N$24  (via drill 0.35)
  Top 0.61: v89.86,50.48 92.72,53.34 U$8.D14
  Bottom 0.61: v89.86,50.48 89.86,48.26 R10.1
N$25  (via drill 0.35)
  Top 0.61: v121.93,52.07 120.97,53.02 101.29,53.02 U$8.D15
  Bottom 0.61: BATTERY_VOLTAGE_INDICATOR.9 121.29,40.01 122.56,41.27 v122.56,44.45 121.93,45.09 v121.93,52.07
N$26  (via drill 0.35)
  Top 0.61: v122.56,40.01 118.75,40.01 118.43,40.32 v118.34,40.54 | v99.7,52.7 100.34,52.07 v118.12,52.07
  Bottom 0.61: v122.56,40.01 123.83,38.73 BATTERY_VOLTAGE_INDICATOR.8 | U$8.D16 99.7,54.61 v99.7,52.7 | v118.12,52.07 120.02,50.16 120.02,41.27 119.39,40.64 118.43,40.64 v118.34,40.54
N$27  (via drill 0.35)
  Top 0.61: v92.08,56.52 92.72,57.15 99.7,57.15 U$8.D17
  Bottom 0.61: v92.08,56.52 90.81,55.24 90.81,50.16 91.13,49.85 91.13,39.37 88.59,36.83 R9.1
N$28  (via drill 0.35)
  Top 0.61: v75.89,66.99 78.75,69.85 92.08,69.85 97.16,74.93 v114.94,74.93
  Bottom 0.61: U$8.A3 68.59,38.1 75.57,45.09 v75.57,62.23 75.89,62.55 v75.89,66.99 | v114.94,74.93 115.89,73.98 115.89,55.88 120.97,50.8 120.97,42.23 RIGHT_STICK.4
N$29  (via drill 0.35)
  Top 0.61: v114.94,67.31 81.92,67.31 77.79,63.18 75.25,63.18 74.62,62.55 v74.62,61.28
  Bottom 0.61: v114.94,67.31 114.94,55.56 117.16,53.34 117.16,43.5 RIGHT_STICK.3 | v74.62,61.28 70.17,56.83 70.17,40.96 68.59,39.37 65.41,39.37 U$8.A2
N$30  (via drill 0.35)
  Top 0.61: LEFT_STICK.3 29.85,40.64 37.15,40.64 38.74,42.23 58.74,42.23 v60.33,40.64 U$8.A4
N$31
  Top 0.61: LEFT_STICK.4 37.15,47.94 58.74,47.94 64.78,41.91 66.68,41.91 U$8.A5
N$32  (via drill 0.35)
  Top 0.61: v99.29,26.67 102.56,26.67 103.51,25.72 104.78,25.72 105.42,26.35 108.27,26.35 v109.54,27.62 | BATTERY_VOLTAGE_INDICATOR.7 126.37,39.05 v110.18,39.05
  Bottom 0.61: R9.2 85.73,36.83 86.05,36.51 86.05,35.24 90.49,35.24 94.3,31.43 v94.57,31.32 94.62,31.11 97.16,31.11 97.16,29.84 97.8,29.21 99.7,29.21 99.7,26.99 99.38,26.67 v99.29,26.67 | BATTERY_VOLTAGE_INDICATOR.7 126.37,31.11 121.93,31.11 v121.93,30.86 | v110.18,39.05 109.54,38.42 v109.54,27.62
N$33  (via drill 0.35)
  Top 0.61: v91.76,68.26 93.35,69.85 101.61,69.85 105.73,73.98 111.13,73.98 114.94,70.17 115.89,70.17 v116.85,69.22 | BATTERY_VOLTAGE_INDICATOR.10 120.02,38.1 v124.78,38.1
  Bottom 0.61: v91.76,68.26 87,63.5 87,48.26 R10.2 | v124.78,38.1 125.1,38.42 125.1,60.96 v116.85,69.22
N$34  (via drill 0.35)
  Top 0.61: v84.46,48.9 89.86,54.29 v96.84,54.29 | v110.81,50.16 114.62,46.35 123.51,46.35 128.59,41.27 128.59,40.01 123.83,40.01 122.56,41.27 122.56,43.5 112.72,43.5 109.23,40.01 109.23,38.1 114.94,38.1 BATTERY_VOLTAGE_INDICATOR.11
  Bottom 0.61: v116.21,31.75 115.89,32.07 115.89,36.51 BATTERY_VOLTAGE_INDICATOR.11 | v84.46,48.9 84.46,43.18 R11.2 | v96.84,54.29 97.16,53.98 97.16,50.16 97.8,49.53 101.92,49.53 101.92,49.85 104.46,52.39 104.46,57.15 105.1,57.78 110.81,57.78 v110.81,50.16
N$35  (via drill 0.35)
  Top 0.61: U$8.D20 82.87,60.96 81.6,59.69 81.39,59.66 81.29,59.37 80.97,59.05 69.22,59.05 68.59,59.69 63.82,59.69 63.51,59.37 62.87,59.37 34.93,59.37 v34.3,58.74
  Bottom 0.61: SSD1306_SCREEN.4 21.91,39.69 21.91,42.86 33.66,54.61 33.66,56.83 33.34,57.15 33.34,57.78 v34.3,58.74
N$36  (via drill 0.35)
  Top 0.61: v32.71,54.93 33.03,55.24 56.84,55.24 58.74,57.15 88.59,57.15 91.13,59.69 96.53,59.69 v96.78,59.74
  Bottom 0.61: U$8.D21 100.97,59.69 96.84,59.69 v96.78,59.74 | SSD1306_SCREEN.3 20.96,43.18 v32.71,54.93
N$37  (via drill 0.35)
  Top 0.61: v59.75,33.45 59.7,33.66 53.98,33.66 v53.73,33.45
  Bottom 0.61: v53.73,33.45 53.66,33.34 51.44,33.34 R2.1 51.44,23.18 ENCODER.1 | U$8.D33 66.68,54.61 59.38,54.61 59.38,33.97 59.7,33.66 v59.75,33.45
N$38
  Bottom 0.61: ENCODER.3 56.52,23.18 R1.1 56.52,34.29 50.49,34.29 49.85,34.92 49.85,39.05 51.44,39.05 53.98,41.59 53.98,44.77 56.52,47.31 56.52,55.88 U$8.D32
N$39  (via drill 0.35)
  Top 0.61: ENCODER.4 51.44,37.78 49.76,37.78 49.45,38.1 v48.9,38.1 v44.77,38.1 | v46.36,44.45 43.82,46.99 v42.55,46.99 | v42.55,62.23 69.22,62.23 v70.49,60.96
  Bottom 0.61: v44.77,38.1 R3.2 | v48.9,38.1 48.9,40.26 48.75,40.41 48.75,42.06 v46.36,44.45 | v42.55,46.99 v42.55,62.23 | U$8.D35 v70.49,60.96
N$40  (via drill 0.35)
  Top 0.61: D1.2 13.34,8.89 23.5,19.05 v32.39,19.05 37.79,24.45 57.79,24.45 v58.11,24.13
  Bottom 0.61: 32.71,19.05 34.93,19.05 R23.1 | 32.71,19.05 32.71,12.06 27.31,6.67 R22.2 | 32.71,19.05 v32.39,19.05 | v58.11,24.13 62.1,28.12 R21.1
N$41  (via drill 0.35)
  Top 0.61: U$8.D34 35.25,58.42 v34.3,57.47
  Bottom 0.61: v34.3,57.47 34.61,57.15 34.61,42.86 LEFT_STICK.5
N$42
  Bottom 0.61: CELL1.A R16.2
N$43  (via drill 0.35)
  Top 0.61: v46.68,56.2 47.95,57.47 54.93,57.47 v55.17,57.53
  Bottom 0.61: BUZZER.+ 43.19,27.94 42.55,28.57 42.55,37.47 39.06,40.96 v38.87,41.07 39.06,41.27 46.68,48.9 v46.68,56.2 | U$8.D45 66.68,69.85 66.68,67.31 64.78,67.31 62.87,65.41 62.87,57.78 55.25,57.78 v55.17,57.53
N$44  (via drill 0.35)
  Top 0.61: U$8.D18 99.7,59.69 106.05,59.69 109.86,55.88 v122.24,55.88
  Bottom 0.61: v122.24,55.88 123.83,54.29 RIGHT_STICK.5
N$45
  Bottom 0.61: CELL2.A 131.45,14.92 127.96,14.92 126.37,16.51 R17.2
N$46
  Bottom 0.61: CELL3.A 131.45,10.16 128.91,10.16 R18.2
N$47
  Bottom 0.61: ALL.A R19.2
N$48  (via drill 0.35)
  Top 0.61: v53.03,60.33 53.66,60.96 U$8.D36
  Bottom 0.61: v53.03,60.33 53.03,43.18 50.81,40.96 MENU.3
N$49  (via drill 0.35)
  Top 0.61: ON.2 121.29,21.59 v117.48,21.59
  Bottom 0.61: R12.2 116.44,22.63 117.25,21.82 117.48,21.82 v117.48,21.59
N$50
  Bottom 0.61: CTRL1.2 98.43,76.2 U$8.D30
N$51
  Bottom 0.61: CTRL2.2 100.97,80.01 U$8.D31
N$52
  Bottom 0.61: U$8.D29 102.24,72.39 102.24,76.52 102.88,77.15 109.54,77.15 109.54,79.06 CTRL3.2 109.54,79.38 109.54,85.72 CTRL3.1
N$53
  Top 0.61: U$8.D27 101.29,68.26 117.16,68.26 117.8,68.9 117.8,79.06 115.26,79.06 CTRL4.1
N$55  (via drill 0.35)
  Top 0.61: v110.5,27.94 109.23,29.21 99.7,29.21 U$8.+5V.1
  Bottom 0.762: v110.5,27.94 112.56,25.88 112.56,25.87 113.44,24.99 R12.1
N$56
  Bottom 0.61: GEAR.RED 69.86,80.64 73.03,77.47 R13.1
N$57
  Bottom 0.61: GEAR.GREEN 72.4,87.31 72.71,87.63 R14.1
N$58
  Bottom 0.61: R15.1 76.84,81.6 73.67,81.6 GEAR.BLUE
N$59
  Bottom 0.61: U$8.D49 70.49,71.75 69.22,73.03 69.22,76.52 70.17,77.47 R13.2
N$60
  Bottom 0.61: U$8.D48 70.49,74.93 75.57,74.93 78.43,77.79 78.43,85.09 75.89,87.63 R14.2
N$61  (via drill 0.35)
  Top 0.61: v74.62,78.42 71.13,74.93 69.22,74.93 U$8.D47
  Bottom 0.61: v74.62,78.42 76.84,78.42 R15.2
N$62  (via drill 0.35)
  Top 0.61: U$8.D5 102.56,42.23 110.18,42.23 113.35,45.4 123.2,45.4 v127.64,40.96
  Bottom 0.61: R16.1 126.37,21.59 126.37,25.08 127.64,26.35 v127.64,40.96
N$63  (via drill 0.35)
  Top 0.61: U$8.D4 94.62,40.64 93.35,39.37 93.35,33.97 95.57,31.75 101.92,31.75 v103.51,30.16 | v120.86,24.77 105.73,24.77 v105.62,25.07
  Bottom 0.61: v105.62,25.07 105.42,25.08 105.42,25.4 104.15,26.67 103.94,26.75 103.83,26.99 103.83,29.84 v103.51,30.16 | R17.1 128.91,16.51 120.97,24.45 120.97,24.77 v120.86,24.77
N$64  (via drill 0.35)
  Top 0.61: v114.58,19.96 114.57,20.05 117.48,17.14 124.78,17.14 v127.96,13.97
  Bottom 0.61: 100.97,36.83 94.3,36.83 92.08,39.05 92.08,40.64 93.03,41.59 v93.12,41.83 | U$8.D3 100.97,36.83 | v127.96,13.97 128.91,13.02 R18.1 | 100.97,36.83 102.24,36.83 102.24,26.99 105.1,24.13 110.42,24.13 v114.58,19.96
N$65  (via drill 0.35)
  Top 0.61: 102.56,36.83 99.7,36.83 U$8.D2 | 102.56,36.83 105.1,36.83 v105.31,36.8 | v137.48,23.18 136.53,24.13 127.45,24.13 125.33,26.24 125.33,28.66 125.1,28.89 124.94,29.05 120.34,33.66 118.12,33.66 117.16,34.61 102.56,34.61 102.56,36.83
  Bottom 0.61: v137.48,23.18 141.61,23.18 R19.1
N$66
  Bottom 0.61: U$8.D50 71.76,72.39 71.76,70.48 71.13,69.85 69.22,69.85 69.22,71.75 68.59,72.39 62.87,72.39 62.87,69.85 U$3.MISO_IN
N$67
  Top 0.61: U$3.MOSI_IN 56.84,66.36 61.6,66.36 62.55,67.31 69.22,67.31 U$8.D51
N$68  (via drill 0.35)
  Top 0.61: U$3.SCK_IN 54.3,63.18 63.19,63.18 64.78,64.77 73.98,64.77 v74.3,65.09
  Bottom 0.61: v74.3,65.09 74.3,72.39 U$8.D52
N$69  (via drill 0.35)
  Top 0.61: U$8.D8 75.57,45.72 74.94,45.72 69.73,45.72 69.27,46.18 69.22,46.35 68.59,46.99 64.14,46.99 64.14,51.75 62.24,53.66 60.97,53.66 60.65,53.34 v50.17,53.34
  Bottom 0.61: U$3.CSN_IN v50.17,53.34
N$70  (via drill 0.35)
  Top 0.61: v87,40.96 93.67,40.96 94.62,41.91 99.7,41.91 U$8.D7 | v85.41,46.67 77.16,54.93 68.9,54.93 68.59,54.61 57.47,54.61 57.16,54.29 49.85,54.29 49.22,53.66 49.22,52.39 54.3,52.39 v54.34,52.5
  Bottom 0.61: v87,40.96 85.41,42.55 v85.41,46.67 | U$3.CE_IN 47.63,52.39 50.49,52.39 51.12,53.02 51.12,61.28 53.35,61.28 53.98,60.64 53.98,53.02 54.3,52.7 v54.34,52.5
N$71  (via drill 0.35)
  Top 0.61: U$8.D41 v79.38,66.04
  Bottom 0.61: R20.1 v79.38,66.04
N$72
  Bottom 0.61: ESC_ARM.K 83.19,66.04 R20.2
VIN  (via drill 0.35)
  Top 0.762: v49.22,78.11 59.7,88.58 124.78,88.58 v132.09,81.28
  Bottom 0.762: MASTER.3 119.39,13.97 122.56,10.79 H1.B2,8 127.96,5.08 127.96,3.81 130.18,1.59 135.58,1.59 135.58,69.22 132.09,72.71 v132.09,81.28 | J1.3 22.23,5.08 22.23,25.4 35.57,38.73 35.57,63.82 49.22,77.47 v49.22,78.11
VIN_SW  (via drill 0.35)
  Top 0.762: v41.28,25.72 41.6,25.4 57.79,25.4 v66.36,25.4 | v117.48,27.3 115.26,29.53 v113.67,29.53 | v116.21,16.51 116.85,15.88 119.39,15.88 MASTER.2
  Bottom 0.762: D1.1 27.63,11.75 27.63,15.88 32.07,20.32 36.84,20.32 36.84,21.27 v41.28,25.72 | v113.67,29.53 113.04,30.16 113.04,35.56 112.08,36.51 112.08,65.09 112.4,65.41 112.4,85.72 109.54,88.58 84.78,88.58 84.78,50.8 80.65,46.67 v80.65,40.01 84.14,36.51 84.14,35.56 87.95,31.75 90.81,31.75 90.81,30.16 86.05,25.4 67.95,25.4 R21.2 67.63,25.4 v66.36,25.4 | U$8.VIN.2 109.86,22.86 v116.21,16.51 116.21,17.78 118.68,20.25 118.68,20.88 118.75,20.95 118.75,24.95 117.54,26.17 117.54,27.25 v117.48,27.3

### Text on the board
tNames: CTRL1 | CTRL2 | CTRL3 | CTRL4 | DESIGN BY V.MERCY | MASTER | LIPO-BAL | LIPO-PWR | - | + | + | -
bNames: DESIGN BY V.MERCY